# Altium project HVAL_TSAL.PrjPcb
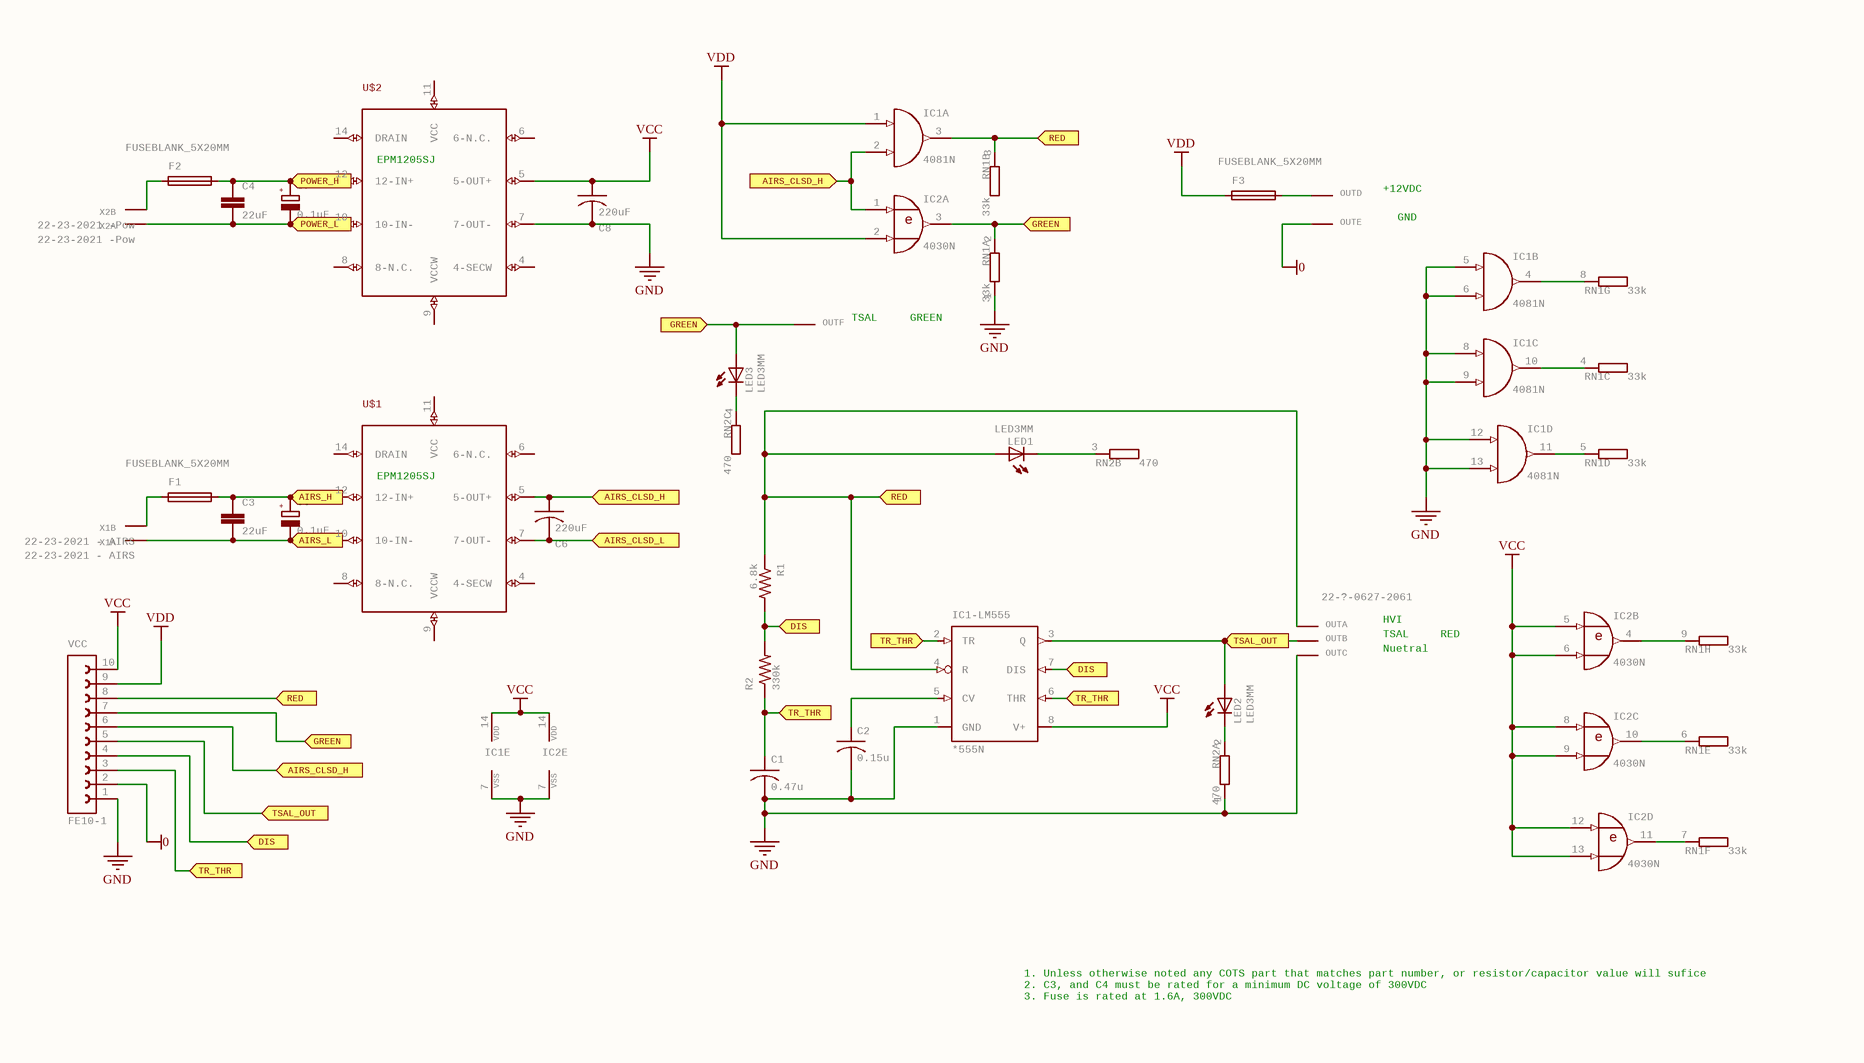
[diagram p0: HVAL_TSAL.SchDoc]
1 sheet, 27 parts. Net scope: flat (ports and power ports of the same name join across sheets).
Board file: HVAL_TSAL.PcbDoc

## Sheet HVAL_TSAL.SchDoc
size 315 x 185 mm; Origin: Eagle

### Parts
C1  0.47u  [C050-075X075]
C2  0.15u  [C050-075X075]
C3  22uF  [C150-091X182]
C4  22uF  [C150-091X182]
C5  0.1uF  [E7,5-16]
C6  220uF  [C050-055X075]
C7  0.1uF  [E7,5-16]
C8  220uF  [C050-055X075]
F1  FUSEBLANK_5X20MM  [FUSE_HOLDER_5X20MM]
F2  FUSEBLANK_5X20MM  [FUSE_HOLDER_5X20MM]
F3  FUSEBLANK_5X20MM  [FUSE_HOLDER_5X20MM]
IC1  4081N  [DIL14]  (parts A,B,C,D,E of 5)
IC1-LM555  *555N  [DIL08]
IC2  4030N  [DIL14]  (parts A,B,C,D,E of 5)
LED1  LED3MM  [LED3MM]
LED2  LED3MM  [LED3MM]
LED3  LED3MM  [LED3MM]
OUT  22-?-0627-2061  [6410-06]  (parts A,B,C,D,E,F of 6)
R1  6.8k  [0309/12]
R2  330k  [0309/12]
RN1  33k  [SIL9]  (parts A,B,C,D,E,F,G,H of 8)
RN2  470  [SIL4]  (parts A,B,C of 3)
U$1  EPM1205SJ  [EPM1205SJ]  (value not drawn)
U$2  EPM1205SJ  [EPM1205SJ]  (value not drawn)
VCC  FE10-1  [FE10]
X1  22-23-2021 - AIRS  [22-23-2021]  (parts A,B of 2)
X2  22-23-2021 -Pow  [22-23-2021]  (parts A,B of 2)

### Ports
AIRS_CLSD_H (in), AIRS_CLSD_L (in), AIRS_H (in), AIRS_L (in), DIS (in), GREEN (in), POWER_H (in), POWER_L (in), RED (in), TR_THR (in), TSAL_OUT (in)

### Nets
0: OUT.5(S) VCC.2
GND: C1.2 C2.2 C8.2 IC1.5(I0) IC1.6(I1) IC1.7(VSS) IC1.8(I0) IC1.9(I1) IC1.12(I0) IC1.13(I1) IC1-LM555.1(GND) IC2.7(VSS) OUT.3(S) RN1.1 RN2.1 U$2.7(7-OUT-) VCC.1
VCC: C8.1 IC1.14(VDD) IC1-LM555.8(V+) IC2.5(I0) IC2.6(I1) IC2.8(I0) IC2.9(I1) IC2.12(I0) IC2.13(I1) IC2.14(VDD) U$2.5(5-OUT+) VCC.10
VDD: F3.1 IC1.1(I0) IC2.2(I1) VCC.9
NetC1_1: C1.1 IC1-LM555.2(TR) IC1-LM555.6(THR) R2.1 VCC.3 ; port TR_THR
NetC2_1: C2.1 IC1-LM555.5(CV)
NetC3_1: C3.1 C5.+ F1.2 U$1.12(12-IN+) ; port AIRS_H
NetC3_2: C3.2 C5.- U$1.10(10-IN-) X1.1(S) ; port AIRS_L
NetC4_1: C4.1 C7.+ F2.2 U$2.12(12-IN+) ; port POWER_H
NetC4_2: C4.2 C7.- U$2.10(10-IN-) X2.1(S) ; port POWER_L
NetC6_1: C6.1 IC1.2(I1) IC2.1(I0) U$1.5(5-OUT+) VCC.6 ; port AIRS_CLSD_H
NetC6_2: C6.2 U$1.7(7-OUT-) ; port AIRS_CLSD_L
NetF1_1: F1.1 X1.2(S)
NetF2_1: F2.1 X2.2(S)
NetF3_2: F3.2 OUT.4(S)
NetIC1-LM555_3: IC1-LM555.3(Q) LED2.A OUT.2(S) VCC.5 ; port TSAL_OUT
NetIC1-LM555_7: IC1-LM555.7(DIS) R1.2 R2.2 VCC.4 ; port DIS
NetIC1_3: IC1.3(O) IC1-LM555.4(R) LED1.A OUT.1(S) R1.1 RN1.3 VCC.8 ; port RED
NetIC1_4: IC1.4(O) RN1.8
NetIC1_10: IC1.10(O) RN1.4
NetIC1_11: IC1.11(O) RN1.5
NetIC2_3: IC2.3(O) LED3.A OUT.6(S) RN1.2 VCC.7 ; port GREEN
NetIC2_4: IC2.4(O) RN1.9
NetIC2_10: IC2.10(O) RN1.6
NetIC2_11: IC2.11(O) RN1.7
NetLED1_K: LED1.K(C) RN2.3
NetLED2_K: LED2.K(C) RN2.2
NetLED3_K: LED3.K(C) RN2.4

Not connected (* = marked no-connect by the designer): U$1 4(4-SECW) 6(6-N.C.) 8(8-N.C.) 9(VCCW) 11(VCC) 14(DRAIN); U$2 4(4-SECW) 6(6-N.C.) 8(8-N.C.) 9(VCCW) 11(VCC) 14(DRAIN)

### Notes on the sheet
- (near U$2) EPM1205SJ
- +12VDC
- GND
- (near OUT) TSAL     GREEN
- (near U$1) EPM1205SJ
- TSAL
- HVI
- Nuetral
- RED
- 1. Unless otherwise noted any COTS part that matches part number, or resistor/capacitor value will sufice
  2. C3, and C4 must be rated for a minimum DC voltage of 300VDC
  3. Fuse is rated at 1.6A, 300VDC

### Library data of the parts
C1 C2 = C-US050-075X075: CAPACITOR, American symbol; GateName_1: G$1; SymbolName_1: C-US; DeviceName: 050-075X075; LibraryName: rcl; DeviceSetName: C-US; SPICEPREFIX: C
C3 C4 = C-EU150-091X182: CAPACITOR, European symbol; GateName_1: G$1; SymbolName_1: C-EU; DeviceName: 150-091X182; LibraryName: rcl; DeviceSetName: C-EU; SPICEPREFIX: C
C5 C7 = CPOL-EUE7.5-16: POLARIZED CAPACITOR, European symbol; GateName_1: G$1; SymbolName_1: CPOL; DeviceName: E7.5-16; LibraryName: rcl; DeviceSetName: CPOL-EU; +: +; SPICEPREFIX: C
C6 C8 = C-US050-055X075: CAPACITOR, American symbol; GateName_1: G$1; SymbolName_1: C-US; DeviceName: 050-055X075; LibraryName: rcl; DeviceSetName: C-US; SPICEPREFIX: C
F1-F3 = FUSEBLANK_5X20MM: Fuse; GateName_1: G$1; SymbolName_1: FUSE; DeviceName: BLANK_5X20MM; LibraryName: fuse; DeviceSetName: FUSE; MF: MF; MPN: MPN; OC_FARNELL: unknown; OC_NEWARK: unknown
IC1 = 4081N: Quad 2-input AND; GateName_1: A; SymbolName_1: 4081; GateName_2: B; GateName_3: C; GateName_4: D; GateName_5: P; SymbolName_5: PWRN; DeviceName: N; SymbolName_2: 4081; SymbolName_3: 4081; SymbolName_4: 4081; LibraryName: 40xx; DeviceSetName: 4081
IC1-LM555 = *555N: TIMER; GateName_1: A; SymbolName_1: 555; DeviceName: N; DeviceSetName: *555; LibraryName: linear
IC2 = 4030N: Quad XOR; GateName_1: A; SymbolName_1: 4030; GateName_2: B; GateName_3: C; GateName_4: D; GateName_5: P; SymbolName_5: PWRN; DeviceName: N; SymbolName_2: 4030; SymbolName_3: 4030; SymbolName_4: 4030; LibraryName: 40xx; DeviceSetName: 4030; e: e
LED1-LED3 = LED3MM: LED   OSRAM: - CHIPLED LG R971, LG N971, LY N971, LG Q971, LY Q971, LO R971, LY R971 LH N974, LH R974 LS Q976, LO Q976, LY Q976 LO Q996 - Hyper CHIPLED LW Q18S LB Q993, LB Q99A, LB R99A - SideLED LS A670, LO A670, LY A670, LG A670, LP A670 LB A673, LV A673, LT A673, LW A673 LH A674 LY A675 LS A676, LA A676, LO A676, LY A676, LW A676 LS A679, LY A679, LG A679 -  Hyper Micro SIDELEDÂ® LS Y876, LA Y876, LO Y876, LY Y876 LT Y87S - SmartLED LW L88C, LW L88S LB L89C, LB L89S, LG L890 LS L89K, LO L89K, LY L89K LS L896, LA L896, LO L896, LY L896 - TOPLED LS T670, LO T670, LY T670, LG T670, LP T670 LSG T670, LSP T670, LSY T670, LOP T670, LYG T670 LG T671, LOG T671, LSG T671 LB T673, LV T673, LT T673, LW T673 LH T674 LS T676, LA T676, LO T676, LY T676, LB T676, LH T676, LSB T676, LW T676 LB T67C, LV T67C, LT T67C, LS T67K, LO T67K, LY T67K, LW E67C LS E67B, LA E67B, LO E67B, LY E67B, LB E67C, LV E67C, LT E67C LW T67C LS T679, LY T679, LG T679 LS T770, LO T770, LY T770, LG T770, LP T770 LB T773, LV T773, LT T773, LW T773 LH T774 LS E675, LA E675, LY E675, LS T675 LS T776, LA T776, LO T776, LY T776, LB T776 LHGB T686 LT T68C, LB T68C - Hyper Mini TOPLEDÂ® LB M676 - Mini TOPLED SantanaÂ® LG M470 LS M47K, LO M47K, LY M47K    Source: http://www.osram.convergy.de   LUXEON: - LUMILEDÂ® LXK2-PW12-R00, LXK2-PW12-S00, LXK2-PW14-U00, LXK2-PW14-V00 LXK2-PM12-R00, LXK2-PM12-S00, LXK2-PM14-U00 LXK2-PE12-Q00, LXK2-PE12-R00, LXK2-PE12-S00, LXK2-PE14-T00, LXK2-PE14-U00 LXK2-PB12-K00, LXK2-PB12-L00, LXK2-PB12-M00, LXK2-PB14-N00, LXK2-PB14-P00, LXK2-PB14-Q00 LXK2-PR12-L00, LXK2-PR12-M00, LXK2-PR14-Q00, LXK2-PR14-R00 LXK2-PD12-Q00, LXK2-PD12-R00, LXK2-PD12-S00 LXK2-PH12-R00, LXK2-PH12-S00 LXK2-PL12-P00, LXK2-PL12-Q00, LXK2-PL12-R00    Source: www.luxeon.com   KINGBRIGHT:   KA-3528ASYC Source: www.kingbright.com; GateName_1: G$1; DeviceName: 3MM; SymbolName_1: LED; LibraryName: led; DeviceSetName: LED
OUT = 22-?-0627-2061: CONNECTOR   wire to board 2.54 mm (.1 inch) pitch header; GateName_1: -1; SymbolName_1: MV; GateName_2: -2; SymbolName_2: M; GateName_3: -3; GateName_4: -4; GateName_5: -5; GateName_6: -6; MF: MOLEX; SymbolName_3: M; SymbolName_4: M; SymbolName_5: M; SymbolName_6: M; DeviceName: 27-2061; LibraryName: con-molex; DeviceSetName: 22-?-06; MPN: MPN; OC_FARNELL: unknown; OC_NEWARK: unknown
R1 R2 = R-US_0309/12: RESISTOR, American symbol; GateName_1: G$1; SymbolName_1: R-US; DeviceSetName: R-US_; DeviceName: 0309/12; LibraryName: resistor
RN1 = GE08R: SIL RESISTOR; GateName_1: A; SymbolName_1: R-NV; GateName_2: B; SymbolName_2: R-NV1; GateName_3: C; GateName_4: D; GateName_5: E; GateName_6: F; GateName_7: G; GateName_8: H; SymbolName_3: R-NV1; SymbolName_4: R-NV1; SymbolName_5: R-NV1; SymbolName_6: R-NV1; SymbolName_7: R-NV1; SymbolName_8: R-NV1; LibraryName: resistor-sil; DeviceSetName: GE08R; MF: MF; MPN: MPN; OC_FARNELL: unknown; OC_NEWARK: unknown
RN2 = GE03R: SIL RESISTOR; GateName_1: A; SymbolName_1: R-NV; GateName_2: B; SymbolName_2: R-NV1; GateName_3: C; SymbolName_3: R-NV1; LibraryName: resistor-sil; DeviceSetName: GE03R; MF: MF; MPN: MPN; OC_FARNELL: unknown; OC_NEWARK: unknown
U$1 U$2 = EPM1205SJ: GateName_1: G$1; SymbolName_1: EPM1205SJ; LibraryName: DC-DC Converter; DeviceSetName: EPM1205SJ
VCC = FE10-1: FEMALE HEADER; GateName_1: G$1; SymbolName_1: FE10-1; LibraryName: con-lsta; DeviceSetName: FE10-1; MF: MF; MPN: MPN; OC_FARNELL: unknown; OC_NEWARK: unknown
X1 X2 = 22-23-2021: .100" (2.54mm) Center Header - 2 Pin; GateName_1: -1; SymbolName_1: MV; GateName_2: -2; SymbolName_2: M; MF: MOLEX; LibraryName: con-molex; DeviceSetName: 22-23-2021; MPN: 22-23-2021; OC_FARNELL: 1462926; OC_NEWARK: 25C3832